# Altium project LAD_MCU.PrjPcb (part 1 of 2)
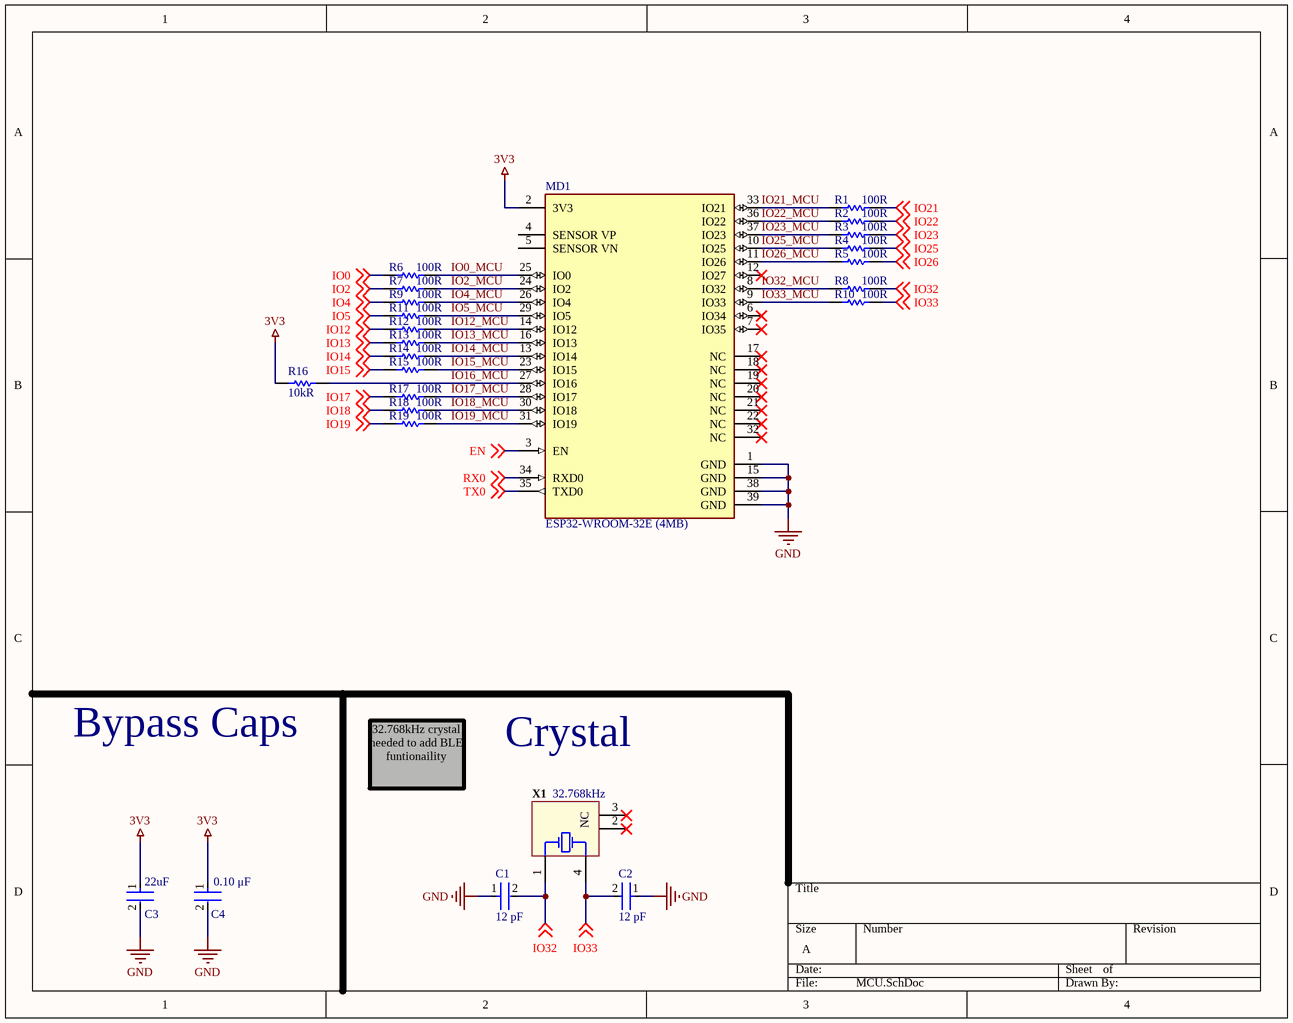
[diagram p0: MCU.SchDoc]
5 sheets, 61 parts. Net scope: global (net labels, ports and power ports of the same name join across sheets).
Board file: MCU.PcbDoc
Sheets:
  MCU.SchDoc
  Connectors.SchDoc
  USB.SchDoc
  Programming.SchDoc
  Power.SchDoc

## Sheet MCU.SchDoc
size A; SheetNumber: 1; SheetTotal: 5

### Parts
C1  value 12 pF  [FP-C0805C-DN-MFG]  (hidden comment: C0805C120J5GACTU)
C2  value 12 pF  [FP-C0805C-DN-MFG]  (hidden comment: C0805C120J5GACTU)
C3  Capacitance: 22uF  [FP-GRM21B-0_15-MFG]  (hidden comment: GRM21BR60J226ME39L)
C4  value 0.10 μF  [FP-C1206C-EB-MFG]  (hidden comment: C1206C104K1RACTU)
MD1  ESP32-WROOM-32E (4MB)  [FP-ESP32-WROOM-32E_4MB-MFG]
R1  value 100R  [RESC3216X65X50NL15T25]  (hidden comment: TNPW1206100RBEEN)
R2  value 100R  [RESC3216X65X50NL15T25]  (hidden comment: TNPW1206100RBEEN)
R3  value 100R  [RESC3216X65X50NL15T25]  (hidden comment: TNPW1206100RBEEN)
R4  value 100R  [RESC3216X65X50NL15T25]  (hidden comment: TNPW1206100RBEEN)
R5  value 100R  [RESC3216X65X50NL15T25]  (hidden comment: TNPW1206100RBEEN)
R6  value 100R  [RESC3216X65X50NL15T25]  (hidden comment: TNPW1206100RBEEN)
R7  value 100R  [RESC3216X65X50NL15T25]  (hidden comment: TNPW1206100RBEEN)
R8  value 100R  [RESC3216X65X50NL15T25]  (hidden comment: TNPW1206100RBEEN)
R9  value 100R  [RESC3216X65X50NL15T25]  (hidden comment: TNPW1206100RBEEN)
R10  value 100R  [RESC3216X65X50NL15T25]  (hidden comment: TNPW1206100RBEEN)
R11  value 100R  [RESC3216X65X50NL15T25]  (hidden comment: TNPW1206100RBEEN)
R12  value 100R  [RESC3216X65X50NL15T25]  (hidden comment: TNPW1206100RBEEN)
R13  value 100R  [RESC3216X65X50NL15T25]  (hidden comment: TNPW1206100RBEEN)
R14  value 100R  [RESC3216X65X50NL15T25]  (hidden comment: TNPW1206100RBEEN)
R15  value 100R  [RESC3216X65X50NL15T25]  (hidden comment: TNPW1206100RBEEN)
R16  value 10kR  [RESC2013X60X35NL10T20]  (hidden comment: RC0805FR-0710KL)
R17  value 100R  [RESC3216X65X50NL15T25]  (hidden comment: TNPW1206100RBEEN)
R18  value 100R  [RESC3216X65X50NL15T25]  (hidden comment: TNPW1206100RBEEN)
R19  value 100R  [RESC3216X65X50NL15T25]  (hidden comment: TNPW1206100RBEEN)
X1  Frequency: 32.768kHz  [ABRA-ABS25-4_V]  (hidden comment: ABS25-32.768KHZ-6-T)

### Nets
3V3: C3.1 C4.1 MD1.2(3V3) R16.2
GND: C1.1 C2.1 C3.2 C4.2 MD1.1(GND) MD1.15(GND) MD1.38(GND) MD1.39(GND)
EN: MD1.3(EN) ; off-sheet EN
IO0: R6.1 ; off-sheet IO0
IO0_MCU: MD1.25(IO0) R6.2
IO2: R7.1 ; off-sheet IO2
IO2_MCU: MD1.24(IO2) R7.2
IO4: R9.1 ; off-sheet IO4
IO4_MCU: MD1.26(IO4) R9.2
IO5: R11.1 ; off-sheet IO5
IO5_MCU: MD1.29(IO5) R11.2
IO12: R12.1 ; off-sheet IO12
IO12_MCU: MD1.14(IO12) R12.2
IO13: R13.1 ; off-sheet IO13
IO13_MCU: MD1.16(IO13) R13.2
IO14: R14.1 ; off-sheet IO14
IO14_MCU: MD1.13(IO14) R14.2
IO15: R15.1 ; off-sheet IO15
IO15_MCU: MD1.23(IO15) R15.2
IO16_MCU: MD1.27(IO16) R16.1
IO17: R17.1 ; off-sheet IO17
IO17_MCU: MD1.28(IO17) R17.2
IO18: R18.1 ; off-sheet IO18
IO18_MCU: MD1.30(IO18) R18.2
IO19: R19.1 ; off-sheet IO19
IO19_MCU: MD1.31(IO19) R19.2
IO21: R1.2 ; off-sheet IO21
IO21_MCU: MD1.33(IO21) R1.1
IO22: R2.2 ; off-sheet IO22
IO22_MCU: MD1.36(IO22) R2.1
IO23: R3.2 ; off-sheet IO23
IO23_MCU: MD1.37(IO23) R3.1
IO25: R4.2 ; off-sheet IO25
IO25_MCU: MD1.10(IO25) R4.1
IO26: R5.2 ; off-sheet IO26
IO26_MCU: MD1.11(IO26) R5.1
IO32: C1.2 R8.2 X1.1(X1) ; off-sheet IO32
IO32_MCU: MD1.8(IO32) R8.1
IO33: C2.2 R10.2 X1.4(X2) ; off-sheet IO33
IO33_MCU: MD1.9(IO33) R10.1
RX0: MD1.34(RXD0) ; off-sheet RX0
TX0: MD1.35(TXD0) ; off-sheet TX0

Not connected (* = marked no-connect by the designer): MD1 4(SENSOR_VP) 5(SENSOR_VN) 6(IO34)* 7(IO35)* 12(IO27)* 17(NC)* 18(NC)* 19(NC)* 20(NC)* 21(NC)* 22(NC)* 32(NC)*; X1 2(NC)* 3(NC)*

### Notes on the sheet
- Bypass Caps
- Crystal
- 32.768kHz crystal needed to add BLE funtionaility

### Library data of the parts
C1 C2 = CMP-2007-00441-2: CAP CER 12PF 50V C0G/NP0 0805; Manufacturer: KEMET; Temperature Characteristic: C0G; Temperature Coefficient: 30ppm/°C; Material: Ceramic; Tolerance: 0.05; Multilayer: Yes; Tolerance  (fill in as +-): 5%; Capacitance: 12 pF; Height: 0.88mm; ComponentLink2URL: https://content.kemet.com/datasheets/KEM_C1003_C0G_SMD.pdf; Automotive: No; Device Class L2: Capacitors; Digikey Description: CAP CER 12PF 50V C0G/NP0 0805; Device Class L3: Ceramic Capacitors; Voltage Rating: 50 V; Mouser Description: Multilayer Ceramic Capacitors MLCC - SMD/SMT 50volts 12pF C0G 5%; Device Class L1: Passive Components; ComponentLink2Description: Datasheet; RoHS: TRUE; Temperature Range High: +125°C; Lead Free: Yes; Category: Cap; Ipc Land Pattern Name: CAPC200125X78; Package: C0805C-DN; Manufacturer Part Number: C0805C120J5GACTU; Octopart: https://octopart.com/c0805c120j5gactu-kemet-126518; Temperature Range Low: -55°C; Temperature: -55°C to +125°C; Supplier: Digikey; Supplier Part Number: 399-C0805C120J5GAC7800CT-ND; Stock: 105044; Pricing: 1=0.12, 10=0.081, 50=0.0482, 100=0.038, 500=0.02804, 1000=0.02321 (USD); Mounting Technology: Surface Mount; Pins: 2; Dielectric Material: Ceramic; Case/Package: 0805; Terminal Finish: Nickel; Package Shape: Rectangular; Min Operating Temperature: -55°C; Max Operating Temperature: 125°C; JESD-609 Code: e3; Capacitor Type: Ceramic; Packaging: Tape and Reel; Tolerance (fill in as +-): 5%; Rated DC Voltage (URdc): 50V; Temperature Characteristics Code: C0G; Termination: Wraparound; Reach SVHC Compliant: Yes; RoHS Compliant: Yes; ComponentLink1URL: https://datasheet.ciiva.com:443/pdfs/VipMasterIC/IC/KEME/KEME-S-A0007600110/KEME-S-A0007597378-1.pdf?src-supplier=IHS+Markit; ComponentLink1Description: https://datasheet.ciiva.com:443/pdfs/VipMasterIC/IC/KEME/KEME-S-A0007600110/KEME-S-A0007597378-1.pdf?src-supplier=IHS+Markit
C3 = CMP-2007-03385-2: Chip Multilayer Ceramic Capacitors for General Purpose, 0805, 22uF, X5R, 15%, 20%, 6.3V; Manufacturer: Murata; Multilayer: Yes; Material: Ceramic; Max Operating Temperature: 85°C; Voltage: 6.3V; Min Operating Temperature: -55°C; Case/Package: 0805; Thickness: 0.053inch; Dielectric: X5R; Packaging: Tape and Reel; Depth: 1.25mm; Termination: SMD/SMT; Voltage Rating (DC): 6.3V; Radiation Hardening: No; Tolerance: 20%; Mount: Surface Mount; Lead Free: Lead Free; Package Quantity: 1; REACH SVHC: No SVHC; Voltage Rating: 6.3V; Length: 2mm; Case Code (Imperial): 0805; Case Code (Metric): 2012; Width: 0.049inch; Height: 1.25mm; Supplier: Digikey; Supplier Part Number: 490-1719-1-ND; Manufacturer Part Number: GRM21BR60J226ME39L; RoHS: Yes; Category: Ceramic Capacitors; Stock: 3670406; Pricing: 1=0.3, 10=0.196, 50=0.1444, 100=0.1177, 500=0.09288, 1000=0.07844 (USD); Mounting Technology: Surface Mount; Pins: 2; Dielectric Material: Ceramic; Package Shape: Rectangular; Terminal Finish: Nickel; JESD-609 Code: e3; Value: 22uF; Capacitor Type: Ceramic; Tolerance  (fill in as +-): 20%; Package Style: SMTMeter; Tolerance (fill in as +-): 20%; Rated DC Voltage (URdc): 6.3V; Temperature Characteristics Code: X5R; Reach SVHC Compliant: Yes; RoHS Compliant: Yes; ComponentLink1URL: https://psearch.en.murata.com:443/capacitor/product/GRM21BR60J226ME39%23.pdf?src-supplier=IHS+Markit; ComponentLink1Description: https://psearch.en.murata.com:443/capacitor/product/GRM21BR60J226ME39%23.pdf?src-supplier=IHS+Markit
C4 = CMP-03020-000153-1: CAP CER 0.1UF 100V X7R 1206; Manufacturer: KEMET; Tolerance: 0.1; Material: Ceramic; Temperature Coefficient: 15%; Automotive Grade: Grade 0; Multilayer: Yes; Tolerance  (fill in as +-): 10%; Voltage Rating: 100 V; Automotive: Yes; Ipc Land Pattern Name: CAPC320160X78; Device Class L1: Passive Components; ComponentLink2Description: Datasheet; Temperature Range Low: -55°C; Category: Cap; Octopart: https://octopart.com/c1206c104k1ractu-kemet-89521; Height: 0.88mm; Lead Free: Yes; Digikey Description: CAP CER 0.1UF 100V X7R 1206; Mouser Description: CAP CER 0.1UF 100V X7R 1206; Device Class L3: Ceramic Capacitors; Device Class L2: Capacitors; ComponentLink2URL: https://content.kemet.com/datasheets/KEM_C1007_X8R_ULTRA_150C_SMD.pdf; Temperature Range High: +150°C; Temperature Characteristic: X7R; Manufacturer Part Number: C1206C104K1RACTU; RoHS: TRUE; Capacitance: 0.10 μF; Package: C1206C-EB; Temperature: -55°C to +150°C; Supplier: Digikey; Supplier Part Number: 399-C1206C104K1RAC7800CT-ND; Stock: 96437; Pricing: 1=0.22, 10=0.144, 50=0.101, 100=0.0816, 500=0.0606, 1000=0.05302 (USD); Mounting Technology: Surface Mount; Pins: 2; Dielectric Material: Ceramic; Case/Package: 1206; Terminal Finish: Nickel; Package Shape: Rectangular; Min Operating Temperature: -55°C; Max Operating Temperature: 125°C; JESD-609 Code: e3; Capacitor Type: Ceramic; Packaging: Tape and Reel; Tolerance (fill in as +-): 10%; Rated DC Voltage (URdc): 100V; Temperature Characteristics Code: X7R; Package Style: SMTMeter; Termination: Wraparound; Length: 3.2mm; Width: 1.6mm; Reach SVHC Compliant: Yes; RoHS Compliant: Yes; ComponentLink1URL: https://datasheet.ciiva.com:443/pdfs/VipMasterIC/IC/KEME/KEME-S-A0008991654/KEME-S-A0008991654-1.pdf?src-supplier=IHS+Markit; ComponentLink1Description: https://datasheet.ciiva.com:443/pdfs/VipMasterIC/IC/KEME/KEME-S-A0008991654/KEME-S-A0008991654-1.pdf?src-supplier=IHS+Markit
MD1 = CMP-194065-000026-1: RX TXRX MOD WIFI TRACE ANT SMD
R1-R15 R17-R19 = CMP-2003-04635-1: Manufacturer: Vishay Dale; Manufacturer Series: TNPW; Tolerance: 0.1%; Power: 250mW; Rated Temperature: 70°C; Temperature Coefficient: 25ppm/°C; Working Voltage: 200V; Part Number: TNPW1206100RBEEN; Supplier: Digikey; Supplier Part Number: 541-3833-1-ND; Manufacturer Part Number: TNPW1206100RBEEN; RoHS: Yes; Category: Chip SMD Resistors; Stock: 9436; Pricing: 1=0.93, 10=0.658, 50=0.5002, 100=0.4416, 500=0.32664 (USD); Mounting Technology: Surface Mount; Pins: 2; Case/Package: 1206; Terminal Finish: Tin; Package Shape: Rectangular; Min Operating Temperature: -55°C; Max Operating Temperature: 125°C; JESD-609 Code: e3; Resistor Type: FIXED RESISTOR; Packaging: Tape and Reel; Technology: THIN FILM; Termination: Wraparound; Reach SVHC Compliant: Yes; RoHS Compliant: Yes; ComponentLink1URL: https://datasheet.ciiva.com:443/pdfs/VipMasterIC/IC/DALE/DALES05753/DALES05753-1.pdf?src-supplier=IHS+Markit; ComponentLink1Description: https://datasheet.ciiva.com:443/pdfs/VipMasterIC/IC/DALE/DALES05753/DALES05753-1.pdf?src-supplier=IHS+Markit; ComponentLink2URL: https://datasheet.ciiva.com/2613/tnpw-e3-2613292.pdf?src-supplier=Digikey; ComponentLink2Description: https://datasheet.ciiva.com/2613/tnpw-e3-2613292.pdf?src-supplier=Digikey; ComponentLink3URL: https://datasheet.ciiva.com/8979/tnpw-e3-8979929.pdf?src-supplier=Avnet; ComponentLink3Description: https://datasheet.ciiva.com/8979/tnpw-e3-8979929.pdf?src-supplier=Avnet; ComponentLink4URL: https://datasheet.ciiva.com/8981/tnpw-e3-8981015.pdf?src-supplier=Avnet; ComponentLink4Description: https://datasheet.ciiva.com/8981/tnpw-e3-8981015.pdf?src-supplier=Avnet
R16 = CMP-1659-00013-4: Chip Resistor, 10 KOhm, +/- 1%, 0.125 W, -55 to 155 degC, 0805 (2012 Metric), RoHS, Tape and Reel; Manufacturer: Yageo; Voltage Rating: 150 V; Power: 125mW; Rated Temperature: 70°C; Temperature Coefficient: 100ppm/°C; Additional Feature: LASER TRIMMABLE; Working Voltage: 150V; Package Length: 2mm; Package Height: 0.5mm; Package Width: 1.25mm; Mount: Surface Mount; ComponentLink1Description: Manufacturer URL; ComponentLink2URL: http://www.yageo.com/documents/recent/PYu-RC_Group_51_RoHS_L_04.pdf; Pins: 2; Length: 2 mm; Min Operating Temperature: -55 degC; Height: 0.5 mm; Mounting Technology: Surface Mount; RoHSCompliant: true; REACH SVHC: No SVHC; ComponentLink1URL: http://www.yageo.com/; Max Operating Temperature: 155 degC; PackageReference: 0805; DatasheetVersion: Rev. 4, 02/2016; Package Quantity: 5000; Packaging: Tape and Reel; ComponentLink2Description: Datasheet; PackageDescription: 2-Pin Surface Mounted Device, Body 2 x 1.25 mm; Supplier: Digikey; Supplier Part Number: 311-10.0KCRCT-ND; Manufacturer Part Number: RC0805FR-0710KL; RoHS: Yes; Category: Chip SMD Resistors; Stock: 4430741; Pricing: 1=0.1, 10=0.027, 50=0.017, 100=0.0142, 500=0.00976, 1000=0.00844 (USD); Package Shape: Rectangular; Terminal Finish: Nickel; Case/Package: 0805; Tolerance: 1%; JESD-609 Code: e3; Resistor Type: FIXED RESISTOR; Construction: Chip; Package Style: SMTMeter; Technology: METAL GLAZE/THICK FILM; Termination: Wraparound; Reach SVHC Compliant: Yes; RoHS Compliant: Yes; ComponentLink3URL: https://datasheet.ciiva.com:443/pdfs/VipMasterIC/IC/YAGO/YAGO-S-A0008145938/YAGO-S-A0008145938-1.pdf?src-supplier=IHS+Markit; ComponentLink3Description: https://datasheet.ciiva.com:443/pdfs/VipMasterIC/IC/YAGO/YAGO-S-A0008145938/YAGO-S-A0008145938-1.pdf?src-supplier=IHS+Markit; ComponentLink4URL: https://datasheet.ciiva.com/11808/0900766b8106beab-11808151.pdf?src-supplier=Rs; ComponentLink4Description: https://datasheet.ciiva.com/11808/0900766b8106beab-11808151.pdf?src-supplier=Rs; ComponentLink5URL: https://datasheet.ciiva.com/46447/444164-46447563.pdf?src-supplier=Element14; ComponentLink5Description: https://datasheet.ciiva.com/46447/444164-46447563.pdf?src-supplier=Element14; ComponentLink6URL: https://datasheet.ciiva.com/2456/pyu-r-int-thick-7-2456973.pdf?src-supplier=Digikey; ComponentLink6Description: https://datasheet.ciiva.com/2456/pyu-r-int-thick-7-2456973.pdf?src-supplier=Digikey; ComponentLink7URL: https://datasheet.ciiva.com/2456/pyu-r-int-thick-7-2456974.pdf?src-supplier=Digikey; ComponentLink7Description: https://datasheet.ciiva.com/2456/pyu-r-int-thick-7-2456974.pdf?src-supplier=Digikey; ComponentLink8URL: https://datasheet.ciiva.com/2456/pyu-r-int-thick-7-2456972.pdf?src-supplier=Digikey; ComponentLink8Description: https://datasheet.ciiva.com/2456/pyu-r-int-thick-7-2456972.pdf?src-supplier=Digikey; ComponentLink9URL: https://datasheet.ciiva.com/12669/rc0805-12669688.pdf?src-supplier=Mouser; ComponentLink9Description: https://datasheet.ciiva.com/12669/rc0805-12669688.pdf?src-supplier=Mouser; ComponentLink10URL: https://datasheet.ciiva.com/16747/rc0805-16747087.pdf?src-supplier=Future+Electronics; ComponentLink10Description: https://datasheet.ciiva.com/16747/rc0805-16747087.pdf?src-supplier=Future+Electronics
X1 = CMP-2000-05036-1: Low Frequency Crystal, 32.768 KHz, 6 pF, +/- 20 ppm, -40 to 85 degC, 4-Pin SMD, RoHS, Tape and Reel; Manufacturer: Abracon; Tolerance: 20PPM; ESR: 50kOhms; Case Width: 3.8mm; Case Height: 2.5mm; Case Length: 8mm; Load Capacitance: 6pF; Operating Temperature Range: -40Cto+85C; Package Reference: ABS25; Factory Pack Quantity: 3000; Package Description: 4-Pin Surface Mount Device, Body 8 x 3.8 mm, Pitch 5.5 mm; Termination Style: SMD/SMT; Manufacturer URL: http://www.abracon.com/; Type: LowFrequencyCrystal; Dimensions: 3.8mmWx8mmLx2.5mmH; Product Category: Crystals; Series: ABS25; RoHS: Details; Package / Case: 8mmx3.8mm; Datasheet Version: Jun-17; Brand: ABRACON; Datasheet URL: https://datasheet.ciiva.com/854/abs25-854528.pdf; Packaging: Reel; Mounting Style: SMD/SMT

## Sheet Connectors.SchDoc
size A; SheetNumber: 2; SheetTotal: 5
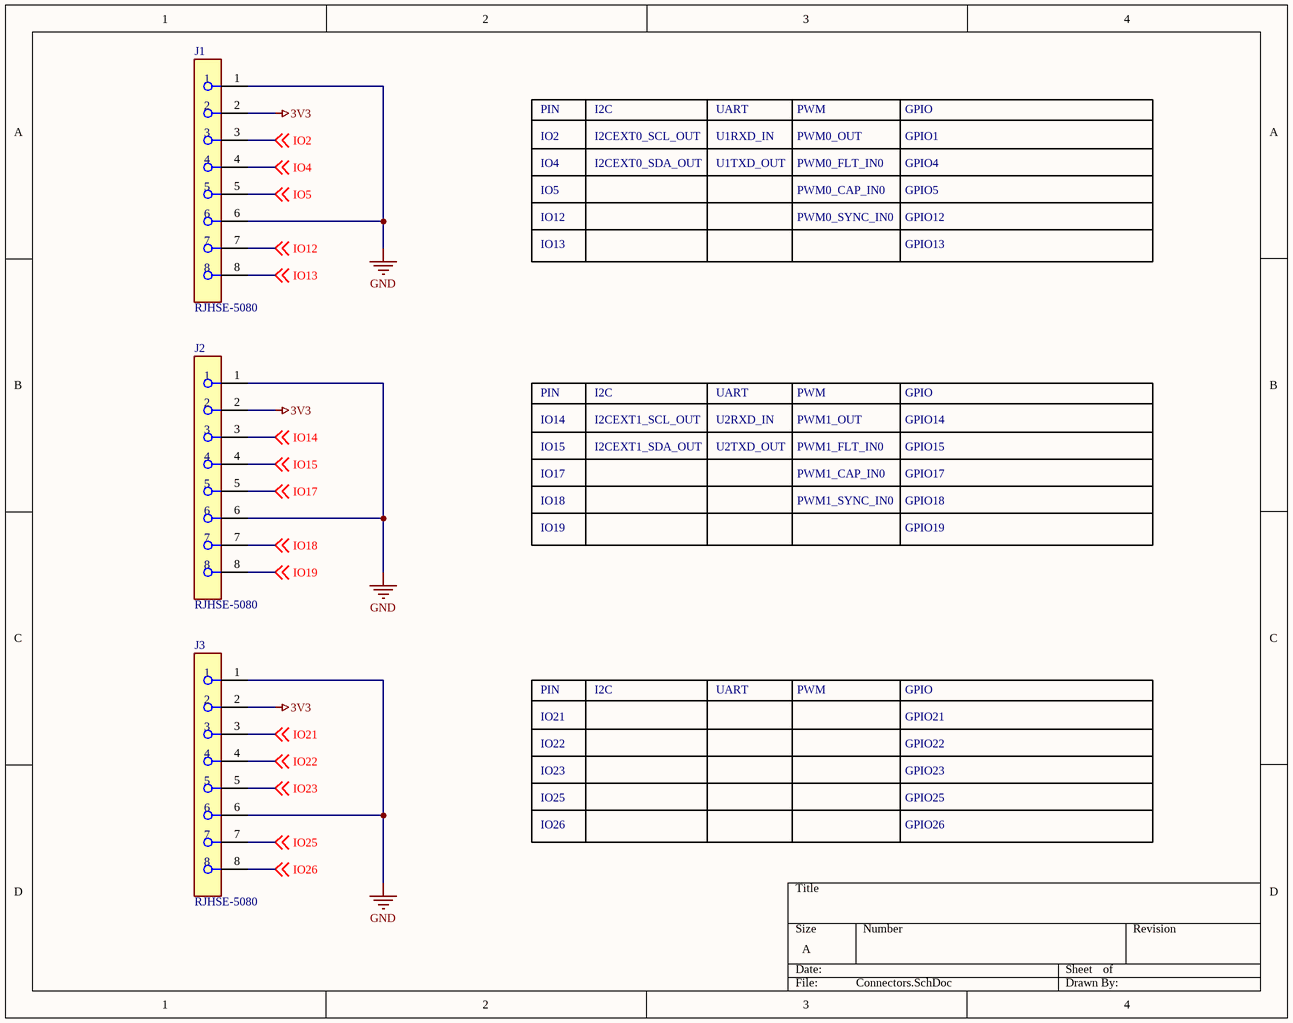
[diagram p1: Connectors.SchDoc]

### Parts
J1  RJHSE-5080  [FP-RJHSE-5080-MFG]
J2  RJHSE-5080  [FP-RJHSE-5080-MFG]
J3  RJHSE-5080  [FP-RJHSE-5080-MFG]

### Nets
3V3: J1.2 J2.2 J3.2
GND: J1.1 J1.6 J2.1 J2.6 J3.1 J3.6
IO2: J1.3 ; off-sheet IO2
IO4: J1.4 ; off-sheet IO4
IO5: J1.5 ; off-sheet IO5
IO12: J1.7 ; off-sheet IO12
IO13: J1.8 ; off-sheet IO13
IO14: J2.3 ; off-sheet IO14
IO15: J2.4 ; off-sheet IO15
IO17: J2.5 ; off-sheet IO17
IO18: J2.7 ; off-sheet IO18
IO19: J2.8 ; off-sheet IO19
IO21: J3.3 ; off-sheet IO21
IO22: J3.4 ; off-sheet IO22
IO23: J3.5 ; off-sheet IO23
IO25: J3.7 ; off-sheet IO25
IO26: J3.8 ; off-sheet IO26

### Notes on the sheet
- PIN
- IO2
- IO4
- I2C
- I2CEXT0_SCL_OUT
- I2CEXT0_SDA_OUT
- UART
- U1RXD_IN
- U1TXD_OUT
- PWM
- PWM0_OUT
- PWM0_FLT_IN0
- GPIO
- GPIO1
- GPIO4
- IO5
- IO12
- PWM0_CAP_IN0
- PWM0_SYNC_IN0
- GPIO5
- GPIO12
- IO13
- GPIO13
- IO14
- I2CEXT1_SCL_OUT
- U2RXD_IN
- PWM1_OUT
- GPIO14
- IO15
- IO17
- IO18
- I2CEXT1_SDA_OUT
- U2TXD_OUT
- PWM1_FLT_IN0
- PWM1_CAP_IN0
- PWM1_SYNC_IN0
- GPIO15
- GPIO17
- GPIO18
- IO19
- GPIO19
- IO21
- IO22
- IO23
- GPIO21
- GPIO22
- GPIO23
- IO25
- IO26
- GPIO25
- GPIO26

### Library data of the parts
J1-J3 = CMP-02366-000003-1: CONN MOD JACK 8P8C R/A UNSHLD; Manufacturer: Amphenol; Current Rating: 1.5A; Voltage Rating: 125V; Pitch: 1.02mm; Conn Orientation: Right Angle; Number Of Contacts: 8; Is Female: yes; Conn Gender: Female; Connector Type: TELECOM AND DATACOM CONNECTOR; Contact Style: TELCOM, MODULAR; Number of Ports: 1; PCB Contact Pattern: STAGGERED; Option: General Purpose; Empty Shell: No; Body Breadth: 0.52inch; Body Depth: 0.59inch; Body Length: 0.62inch; Mounting Option 1: LOCKING; Plating Thickness: 50uin; Reference Standard: UL; Reliability: COMMERCIAL; Lead Free: Yes; Device Class L3: unset; Footprint Url: https://cdn.amphenol-icc.com/media/wysiwyg/files/drawing/rjhse5080.pdf?__cf_chl_jschl_tk__=e349db0bbbb6188a39347cd5e541b92fa02c9719-1587748343-0-AW7tChdeHzRPLX9gSWj7WrKaXQoY9BsmT9Ek0h-T62M9y3Rs9iypFcOtkzb-6sGYQEjFE-jcoNciDETCOZrh1rYyOesac5SvYLoLwHIsHvF4AKBlx-MXmfZUVk9OTTJLqyQq2qMm0PFRLJpNcK0nrKResqOniRSYixG2sPTmOPraH-ULJFBDL602CHqcI9KKBgTq90Jh1OL2Td4moJ99rFsJRJ1Tk_uoxGe8ublcP_ARu-uLpWcQrBcwOcHDTAwL29DAwVaqcH7ta8Ks7WMlHmVl_pILeEDwT0bE9vu5Pa5S3PtNRF1leuFkgi_FMbUxTDulc5xzbXSfng8srUIV1lWXny5nx1fZJEUa_w97yKjffzBMxiWLWVN-V7-uqAaPbyv_m-wRyw5O25OZNyJOeGU; ComponentLink2URL: https://cdn.amphenol-icc.com/media/wysiwyg/files/documentation/datasheet/inputoutput/io-modjack-rjhse.pdf; Device Class L1: Connectors; Package: CONN_MOD_JACK; Mouser Description: Modular Connectors / Ethernet Connectors R/A RJ45 NONSHIELDED 8 CONT NO LEDS; Manufacturer Part Number: RJHSE-5080; Octopart: https://octopart.com/rjhse-5080-amphenol-45060; Category: Conn; Height: 0.535inch; Temperature: -55°C to +85°C; Digikey Description: CONN MOD JACK 8P8C R/A UNSHLD; Device Class L2: Modular / Ethernet Connectors; Contact Material: Gold,Nickel; ComponentLink2Description: Datasheet; Temperature Range Low: -55°C; RoHS: TRUE; Automotive: No; Temperature Range High: +85°C; Supplier: Digikey; Supplier Part Number: RJHSE-5080-ND; Stock: 69947; Pricing: 1=1.03, 10=0.867, 36=0.83194, 72=0.81417, 108=0.7788, 252=0.70802, 504=0.6372, 1008=0.56641, 2520=0.51331 (USD); Mounting Technology: Panel,Board; Contact Finish - Mating: GOLD (50) OVER NICKEL (50); Contact Finish - Termination: Matte Tin (Sn); Insulation Color: Black; Insulation Material: Thermoplastic; Shell Material: Polyethylene; JESD-609 Code: e3; Body/Shell Style: JACK; Contact Gender: Female; Mounting Style: RIGHT ANGLE; Termination: Solder; Filter Feature: No; Mixed Contacts: No; Terminal Length: 0.1inch; Terminal Pitch: 2.032mm; Flammability Rating: UL94 V-0; Reach SVHC Compliant: Yes; RoHS Compliant: Yes; DIN Conformance: No; IEC Conformance: No; MIL Conformance: No; ComponentLink1URL: https://datasheet.ciiva.com:443/pdfs/VipMasterIC/IC/AMPH/AMPH-S-A0001396201/AMPH-S-A0001290431-1.pdf?src-supplier=IHS+Markit; ComponentLink1Description: https://datasheet.ciiva.com:443/pdfs/VipMasterIC/IC/AMPH/AMPH-S-A0001396201/AMPH-S-A0001290431-1.pdf?src-supplier=IHS+Markit; ComponentLink3URL: https://datasheet.ciiva.com/685/rjhse5080-685586.pdf?src-supplier=Digikey; ComponentLink3Description: https://datasheet.ciiva.com/685/rjhse5080-685586.pdf?src-supplier=Digikey; ComponentLink4URL: https://datasheet.ciiva.com/7629/1682821-7629402.pdf?src-supplier=Element14; ComponentLink4Description: https://datasheet.ciiva.com/7629/1682821-7629402.pdf?src-supplier=Element14; ComponentLink5URL: https://datasheet.ciiva.com/15171/getdatasheetpartid-643190-15171163.pdf?src-supplier=Verical; ComponentLink5Description: https://datasheet.ciiva.com/15171/getdatasheetpartid-643190-15171163.pdf?src-supplier=Verical; ComponentLink6URL: https://datasheet.ciiva.com/1432/1693748-1432448.pdf?src-supplier=Element14; ComponentLink6Description: https://datasheet.ciiva.com/1432/1693748-1432448.pdf?src-supplier=Element14

## Sheet USB.SchDoc
size A; SheetNumber: 3; SheetTotal: 5
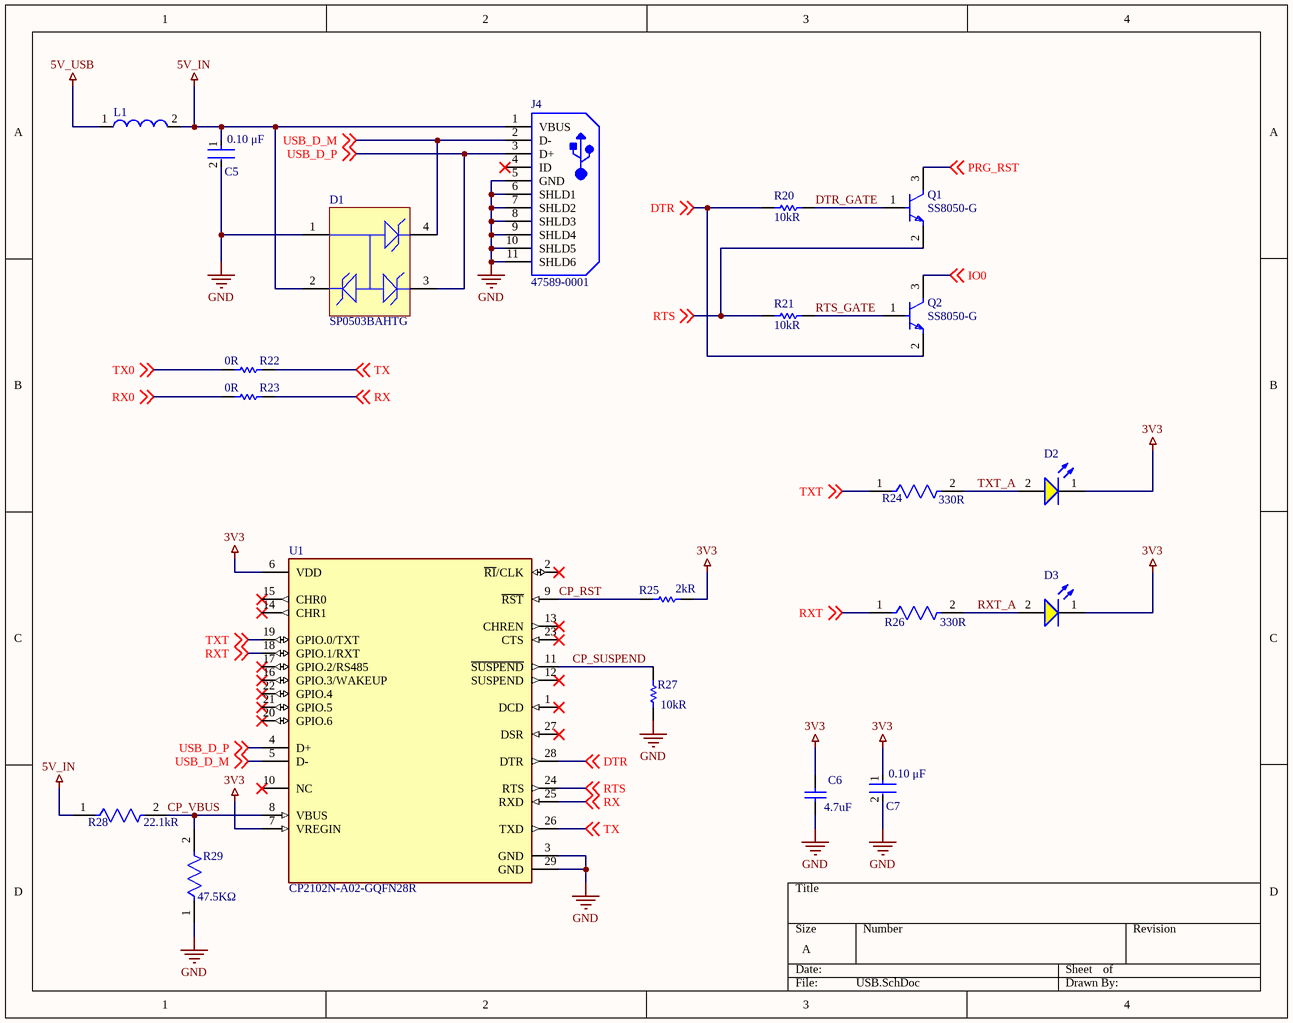
[diagram p2: USB.SchDoc]

### Parts
C5  value 0.10 μF  [FP-C1206C-EB-MFG]  (hidden comment: C1206C104K1RACTU)
C6  value 4.7uF  [CAPC1210(3225)220_M]  (hidden comment: CAP 4.7uF 25V 1210(3225))
C7  value 0.10 μF  [FP-C1206C-EB-MFG]  (hidden comment: C1206C104K1RACTU)
D1  SP0503BAHTG  [LFUS-SOT143-4_V]
D2  150080YS75000  [WL-SMCW_0805_150080xx75000]  (value not drawn)
D3  150080YS75000  [WL-SMCW_0805_150080xx75000]  (value not drawn)
J4  47589-0001  [MOLX-47589-0001_V]
L1  742792093  [SMD-0805]  (value not drawn)
Q1  SS8050-G  [FP-SS8050-G-MFG]
Q2  SS8050-G  [FP-SS8050-G-MFG]
R20  value 10kR  [RESC2013X60X35NL10T20]  (hidden comment: RC0805FR-0710KL)
R21  value 10kR  [RESC2013X60X35NL10T20]  (hidden comment: RC0805FR-0710KL)
R22  value 0R  [RESC2013X50X30LL20T20]  (hidden comment: CRCW08050000Z0EA)
R23  value 0R  [RESC2013X50X30LL20T20]  (hidden comment: CRCW08050000Z0EA)
R24  Resistance: 330R  [FP-CRCW0805-e3-MFG]  (hidden comment: CRCW0805330RFKEA)
R25  value 2kR  [RESC3216X50X50LL20T25]  (hidden comment: RG3216P-2001-B-T1)
R26  Resistance: 330R  [FP-CRCW0805-e3-MFG]  (hidden comment: CRCW0805330RFKEA)
R27  value 10kR  [RESC2013X60X35NL10T20]  (hidden comment: RC0805FR-0710KL)
R28  Resistance: 22.1kR  [FP-RMCF0805-IPC_B]  (hidden comment: RMCF0805FT22K1)
R29  value 47.5KΩ  [FP-RN732A-MFG]  (hidden comment: RN73C2A47K5BTD)
U1  CP2102N-A02-GQFN28R  [FP-CP2102N-A02-GQFN28R-MFG]

### Nets
3V3: C6.2 C7.1 D2.1(K) D3.1(K) R25.2 U1.6(VDD) U1.7(VREGIN)
5V_IN: C5.1 D1.2 J4.1(VBUS) L1.2 R28.1
5V_USB: L1.1
GND: C5.2 C6.1 C7.2 D1.1 J4.5(GND) J4.6(SHLD1) J4.7(SHLD2) J4.8(SHLD3) J4.9(SHLD4) J4.10(SHLD5) J4.11(SHLD6) R27.1 R29.1 U1.3(GND) U1.29(GND)
CP_RST: R25.1 U1.9(~{RST})
CP_SUSPEND: R27.2 U1.11(~{SUSPEND})
CP_VBUS: R28.2 R29.2 U1.8(VBUS)
DTR: Q2.2(E) R20.1 U1.28(DTR) ; off-sheet DTR
DTR_GATE: Q1.1(B) R20.2
IO0: Q2.3(C) ; off-sheet IO0
PRG_RST: Q1.3(C) ; off-sheet PRG_RST
RTS: Q1.2(E) R21.2 U1.24(RTS) ; off-sheet RTS
RTS_GATE: Q2.1(B) R21.1
RX: R23.2 U1.25(RXD) ; off-sheet RX
RX0: R23.1 ; off-sheet RX0
RXT: R26.1 U1.18(GPIO.1/RXT) ; off-sheet RXT
RXT_A: D3.2(A) R26.2
TX: R22.2 U1.26(TXD) ; off-sheet TX
TX0: R22.1 ; off-sheet TX0
TXT: R24.1 U1.19(GPIO.0/TXT) ; off-sheet TXT
TXT_A: D2.2(A) R24.2
USB_D_M: D1.4 J4.2(D-) U1.5(D-) ; off-sheet USB_D_M
USB_D_P: D1.3 J4.3(D+) U1.4(D+) ; off-sheet USB_D_P

Not connected (* = marked no-connect by the designer): J4 4(ID)*; U1 1(DCD)* 2(~{RI}/CLK)* 10(NC)* 12(SUSPEND)* 13(CHREN)* 14(CHR1)* 15(CHR0)* 16(GPIO.3/WAKEUP)* 17(GPIO.2/RS485)* 20(GPIO.6)* 21(GPIO.5)* 22(GPIO.4)* 23(CTS)* 27(DSR)*

### Library data of the parts
C5 C7 = CMP-03020-000153-1: as C4 on sheet MCU; Voltage Rating: 100 V; Automotive: Yes; Ipc Land Pattern Name: CAPC320160X78; Device Class L1: Passive Components; ComponentLink2Description: Datasheet; Temperature Range Low: -55°C; Category: Cap; Octopart: https://octopart.com/c1206c104k1ractu-kemet-89521; Height: 0.88mm; Lead Free: Yes; Digikey Description: CAP CER 0.1UF 100V X7R 1206; Mouser Description: CAP CER 0.1UF 100V X7R 1206; Device Class L3: Ceramic Capacitors; Device Class L2: Capacitors; ComponentLink2URL: https://content.kemet.com/datasheets/KEM_C1007_X8R_ULTRA_150C_SMD.pdf; Temperature Range High: +150°C; Temperature Characteristic: X7R; Manufacturer Part Number: C1206C104K1RACTU; RoHS: TRUE; Capacitance: 0.10 μF; Package: C1206C-EB; Temperature: -55°C to +150°C; Supplier: Digikey; Supplier Part Number: 399-C1206C104K1RAC7800CT-ND; Stock: 96437; Pricing: 1=0.22, 10=0.144, 50=0.101, 100=0.0816, 500=0.0606, 1000=0.05302 (USD); Mounting Technology: Surface Mount; Pins: 2; Dielectric Material: Ceramic; Case/Package: 1206; Terminal Finish: Nickel; Package Shape: Rectangular; Min Operating Temperature: -55°C; Max Operating Temperature: 125°C; JESD-609 Code: e3; Capacitor Type: Ceramic; Packaging: Tape and Reel; Tolerance (fill in as +-): 10%; Rated DC Voltage (URdc): 100V; Temperature Characteristics Code: X7R; Package Style: SMTMeter; Termination: Wraparound; Length: 3.2mm; Width: 1.6mm; Reach SVHC Compliant: Yes; RoHS Compliant: Yes; ComponentLink1URL: https://datasheet.ciiva.com:443/pdfs/VipMasterIC/IC/KEME/KEME-S-A0008991654/KEME-S-A0008991654-1.pdf?src-supplier=IHS+Markit; ComponentLink1Description: https://datasheet.ciiva.com:443/pdfs/VipMasterIC/IC/KEME/KEME-S-A0008991654/KEME-S-A0008991654-1.pdf?src-supplier=IHS+Markit
C6 = CMP-1038-02151-2: CAP 4.7uF 25V ±10% 1210 (3225 Metric) Thickness 2.2mm SMD; Manufacturer: KEMET; Manufacturer Part Number: C1210C475K3RACTU; Case-Metric: 3225; Case-EIA: 1210; Tolerance: Â±10%; Dielectric Material: Ceramic; Multilayer: Yes; Temperature Characteristics Code: X7R; Technology: SMT; Max Thickness: 2.2 mm; Rated Voltage: 25 V; Supplier: Digikey; Supplier Part Number: 399-C1210C475K3RAC7800CT-ND; RoHS: Yes; Category: Ceramic Capacitors; Stock: 9226; Pricing: 1=0.66, 10=0.462, 50=0.3888, 100=0.3166, 500=0.26386, 1000=0.2222 (USD); Mounting Technology: Surface Mount; Pins: 2; Package Shape: Rectangular; Case/Package: 1210; Terminal Finish: Nickel; Min Operating Temperature: -55°C; Max Operating Temperature: 125°C; Capacitor Type: Ceramic; Tolerance  (fill in as +-): 10%; Package Style: SMTMeter; Packaging: Tape and Reel; Tolerance (fill in as +-): 10%; Rated DC Voltage (URdc): 25V; Termination: Wraparound; JESD-609 Code: e3; Length: 3.2mm; Width: 2.5mm; Height: 1.25mm; Reach SVHC Compliant: Yes; RoHS Compliant: Yes; ComponentLink1URL: https://datasheet.ciiva.com:443/pdfs/VipMasterIC/IC/KEME/KEME-S-A0008991654/KEME-S-A0008991654-1.pdf?src-supplier=IHS+Markit; ComponentLink1Description: https://datasheet.ciiva.com:443/pdfs/VipMasterIC/IC/KEME/KEME-S-A0008991654/KEME-S-A0008991654-1.pdf?src-supplier=IHS+Markit
D1 = CMP-2000-05191-1: TVS Diode Array, 30 pF, 30 KV, -40 to 85 degC, 4-Pin SOT143, RoHS, Tape and Reel; Manufacturer: Littelfuse; Direction Type: Uni-Directional; Product Height (mm): 1.05mm; Leakage Current (Max): 0.1uA; Clamping Voltage (Max): 8V; Reverse Stand-off Voltage: 5.5(Min)V; Configuration: Triple; Working Voltage: 5.5V; Product Length (mm): 3.04mm; Working Voltage (Max): 5.5V(Min); Capacitance Value: 30pF; Rad Hardened: No; Number of Elements: 3; Product Depth (mm): 1.4mm; Operating Temperature Max Deg. C: 85C; Suppressor Type: TVS; Operating Temperature Min Deg. C: -40C; Operating Temp Range: -40Cto85C; Mounting: SurfaceMount; Package / Case: SOT-143; Datasheet Version: Dec-13; Package Type: SOT-143; Packaging: TapeandReel; Pin Count: 3+Tab; Operating Temperature Classification: Industrial; Datasheet URL: https://datasheet.ciiva.com/15143/getdatasheetpartid-116020-15143550.pdf; Manufacturer URL: http://www.littelfuse.com/; Leakage Current: 0.1uA; Mounting Style: SurfaceMount; Clamping Voltage: 8V; Polarity: Uni-Directional
D2 D3 = CMP-1426-00012-2: NexarPartId: 29717784; Manufacturer: Wurth Electronics; Dominant Wavelength: 590nm; Max Reverse Voltage (DC): 5V; Forward Voltage: 2V; Peak Wavelength: 595nm; Max Junction Temperature (Tj): 95°C; Lens Style: Clear, Rectangular; Power Dissipation: 72mW; Test Current: 20mA; Color: Yellow; Forward Current: 100mA; Luminous Intensity: 120mcd; Viewing Angle: 140°; Shape: Rectangular; Channels: 1; Optoelectronic Device Type: SINGLE COLOR LED; Overall Height: 0.7mm; Min Operating Temperature: -40°C; Case/Package: 0805; REACH SVHC: Unknown; Max Operating Temperature: 85°C; Case Code (Imperial): 0805; Mount: Surface Mount; Packaging: Tape and Reel; RoHS: Compliant; Case Code (Metric): 2012; Reverse Voltage: 5V; Height: 700µm; Width: 1.25mm; Wavelength: 590nm; Length: 2mm; Supplier: Digikey; Supplier Part Number: 732-4987-1-ND; Manufacturer Part Number: 150080YS75000; Category: LEDs; Stock: 32209; Pricing: 1=0.19, 50=0.176, 100=0.151, 500=0.131 (USD); Mounting Technology: Surface Mount; Pins: 2; Luminous Intensity-Nom: 120mcd; Size: 1.4mm; Terminal Pitch: 2.1mm; Reach SVHC Compliant: Yes; RoHS Compliant: Yes; ComponentLink1URL: https://datasheet.ciiva.com:443/pdfs/VipMasterIC/IC/MIDC/MIDC-S-A0007455942/MIDC-S-A0007455942-1.pdf?src-supplier=IHS+Markit; ComponentLink1Description: https://datasheet.ciiva.com:443/pdfs/VipMasterIC/IC/MIDC/MIDC-S-A0007455942/MIDC-S-A0007455942-1.pdf?src-supplier=IHS+Markit; ComponentLink2URL: https://datasheet.ciiva.com/23843/150080ys75000-23843256.pdf?src-supplier=Newark; ComponentLink2Description: https://datasheet.ciiva.com/23843/150080ys75000-23843256.pdf?src-supplier=Newark; ComponentLink3URL: https://datasheet.ciiva.com/29279/759438-da-01-en-chipled-0805-w-kl-gelb-150080ys75000-29279034.pdf?src-supplier=Conrad; ComponentLink3Description: https://datasheet.ciiva.com/29279/759438-da-01-en-chipled-0805-w-kl-gelb-150080ys75000-29279034.pdf?src-supplier=Conrad; ComponentLink4URL: https://datasheet.ciiva.com/22656/1911353-22656971.pdf?src-supplier=Element14; ComponentLink4Description: https://datasheet.ciiva.com/22656/1911353-22656971.pdf?src-supplier=Element14; ComponentLink5URL: https://datasheet.ciiva.com/29563/150080ys75000-29563020.pdf?src-supplier=Digikey; ComponentLink5Description: https://datasheet.ciiva.com/29563/150080ys75000-29563020.pdf?src-supplier=Digikey; ComponentLink6URL: https://datasheet.ciiva.com/29563/150080ys75000-29563019.pdf?src-supplier=Digikey; ComponentLink6Description: https://datasheet.ciiva.com/29563/150080ys75000-29563019.pdf?src-supplier=Digikey; ComponentLink7URL: https://datasheet.ciiva.com/29563/150080ys75000-29563021.pdf?src-supplier=Digikey; ComponentLink7Description: https://datasheet.ciiva.com/29563/150080ys75000-29563021.pdf?src-supplier=Digikey
J4 = CMP-2000-05610-1: Right Angle Female Type AB Micro USB Connector, 30 V, 1.8 A, -30 to 85 degC, RoHS, Tape and Reel; Number of Ports: 1Port; Current Rating: 1.8A; Brand: Molex; Connector Type: MicroUSBTypeABreceptacle; Number of Contacts: 5Contact; Voltage Rating: 30VAC; Color: Black; Product: MicroUSBTypeABConnectors; Package URL: http://www.molex.com/pdm_docs/sd/475890001_sd.pdf; Contact Plating: Gold; Datasheet URL: http://www.molex.com/webdocs/datasheets/pdf/en-us/0475890001_IO_CONNECTORS.pdf; Operating Temperature Range: -20Cto+85C; Termination Style: SMD/SMT; Mounting Angle: Right; Package Reference: 47589-0001; Gender: Female; Package Description: Micro USB Connector, Pitch 0.65 mm, 5 Positions, Body 7.5 x 5.6 mm; Mounting Technology: SurfaceMount; Contact Material: CopperAlloy; Packaging: Reel; RoHS: True; Standard: USB; Manufacturer URL: http://www.molex.com/; Manufacturer: Molex; Datasheet Version: 12/2016; Product Category: USBConnectors; Series: 47589
L1 = CMP-0220-00169-1: SMD EMI Suppression Ferrite Bead WE-CBF, Z = 2200 Ohm; Manufacturer: Wurth Electronics; DC Resistance-Max: 600mR; Filter Type: FERRITE CHIP; Clock Frequency: 100MHz; Min Frequency: 80MHz; Channels: 1; Output Impedance: 2.2kR; Current Rating: 200mA; DatasheetVersion: Dec-2005; ComponentLink2URL: http://www.we-online.de/katalog/media/pdf/742792093.pdf; PackageDescription: Chip Inductor, 2-Leads, Body 2.0 x 1.2 mm; Impedance: 2200 Ohm; ComponentLink2Description: Datasheet; ComponentLink1Description: Manufacturer Link; PackageReference: SMD-0805; ComponentLink1URL: http://www.we-online.com; PackageVersion: 2005; Supplier: Digikey; Supplier Part Number: 732-1609-1-ND; Manufacturer Part Number: 742792093; RoHS: Yes; Category: Ferrite Beads and Chips; Stock: 137435; Pricing: 1=0.21, 50=0.209, 100=0.192, 500=0.183, 1000=0.176, 2000=0.167 (USD); Mounting Technology: Surface Mount; Material: Ferrite; Case Code: 0805; Terminal Finish: Nickel; Min Operating Temperature: -55°C; Max Operating Temperature: 125°C; JESD-609 Code: e3; Construction: Multi-Layer; Length: 2mm; Width: 1.2mm; Height: 0.9mm; Reach SVHC Compliant: Yes; RoHS Compliant: Yes; ComponentLink3URL: https://datasheet.ciiva.com:443/pdfs/VipMasterIC/IC/MIDC/MIDC-S-A0008919821/MIDC-S-A0008919976-1.pdf?src-supplier=IHS+Markit; ComponentLink3Description: https://datasheet.ciiva.com:443/pdfs/VipMasterIC/IC/MIDC/MIDC-S-A0008919821/MIDC-S-A0008919976-1.pdf?src-supplier=IHS+Markit; ComponentLink4URL: https://datasheet.ciiva.com/1475/742792093-1475025.pdf?src-supplier=Farnell; ComponentLink4Description: https://datasheet.ciiva.com/1475/742792093-1475025.pdf?src-supplier=Farnell; ComponentLink5URL: https://datasheet.ciiva.com/11799/0900766b80bbd134-11799557.pdf?src-supplier=Rs; ComponentLink5Description: https://datasheet.ciiva.com/11799/0900766b80bbd134-11799557.pdf?src-supplier=Rs; ComponentLink6URL: https://datasheet.ciiva.com/4940/742792093-88569-4940476.pdf?src-supplier=Mouser; ComponentLink6Description: https://datasheet.ciiva.com/4940/742792093-88569-4940476.pdf?src-supplier=Mouser; ComponentLink7URL: https://datasheet.ciiva.com/1013/742792093-1013376.pdf?src-supplier=Digikey; ComponentLink7Description: https://datasheet.ciiva.com/1013/742792093-1013376.pdf?src-supplier=Digikey; ComponentLink8URL: https://datasheet.ciiva.com/14122/742792093-eng-tds-14122810.pdf?src-supplier=Distrelec; ComponentLink8Description: https://datasheet.ciiva.com/14122/742792093-eng-tds-14122810.pdf?src-supplier=Distrelec
Q1 Q2 = CMP-20235-000001-1: NPN TRANSISTOR 1.5A 40V SOT-23 R; Transition Frequency: 100MHz; Max Breakdown Voltage: 25V; Collector Emitter Voltage (VCEO): 400mV; Max Power Dissipation: 300mW; Max Collector Current: 1.5A; Case/Package: TO-236-3; Packaging: Tape and Reel; RoHS Compliant: Yes; Mount: Surface Mount; Collector Emitter Breakdown Voltage: 25V
R20 R21 R27 = CMP-1659-00013-4: as R16 on sheet MCU; Mount: Surface Mount; ComponentLink1Description: Manufacturer URL; ComponentLink2URL: http://www.yageo.com/documents/recent/PYu-RC_Group_51_RoHS_L_04.pdf; Pins: 2; Length: 2 mm; Min Operating Temperature: -55 degC; Height: 0.5 mm; Mounting Technology: Surface Mount; RoHSCompliant: true; REACH SVHC: No SVHC; ComponentLink1URL: http://www.yageo.com/; Max Operating Temperature: 155 degC; PackageReference: 0805; DatasheetVersion: Rev. 4, 02/2016; Package Quantity: 5000; Packaging: Tape and Reel; ComponentLink2Description: Datasheet; PackageDescription: 2-Pin Surface Mounted Device, Body 2 x 1.25 mm; Supplier: Digikey; Supplier Part Number: 311-10.0KCRCT-ND; Manufacturer Part Number: RC0805FR-0710KL; RoHS: Yes; Category: Chip SMD Resistors; Stock: 4430741; Pricing: 1=0.1, 10=0.027, 50=0.017, 100=0.0142, 500=0.00976, 1000=0.00844 (USD); Package Shape: Rectangular; Terminal Finish: Nickel; Case/Package: 0805; Tolerance: 1%; JESD-609 Code: e3; Resistor Type: FIXED RESISTOR; Construction: Chip; Package Style: SMTMeter; Technology: METAL GLAZE/THICK FILM; Termination: Wraparound; Reach SVHC Compliant: Yes; RoHS Compliant: Yes; ComponentLink3URL: https://datasheet.ciiva.com:443/pdfs/VipMasterIC/IC/YAGO/YAGO-S-A0008145938/YAGO-S-A0008145938-1.pdf?src-supplier=IHS+Markit; ComponentLink3Description: https://datasheet.ciiva.com:443/pdfs/VipMasterIC/IC/YAGO/YAGO-S-A0008145938/YAGO-S-A0008145938-1.pdf?src-supplier=IHS+Markit; ComponentLink4URL: https://datasheet.ciiva.com/11808/0900766b8106beab-11808151.pdf?src-supplier=Rs; ComponentLink4Description: https://datasheet.ciiva.com/11808/0900766b8106beab-11808151.pdf?src-supplier=Rs; ComponentLink5URL: https://datasheet.ciiva.com/46447/444164-46447563.pdf?src-supplier=Element14; ComponentLink5Description: https://datasheet.ciiva.com/46447/444164-46447563.pdf?src-supplier=Element14; ComponentLink6URL: https://datasheet.ciiva.com/2456/pyu-r-int-thick-7-2456973.pdf?src-supplier=Digikey; ComponentLink6Description: https://datasheet.ciiva.com/2456/pyu-r-int-thick-7-2456973.pdf?src-supplier=Digikey; ComponentLink7URL: https://datasheet.ciiva.com/2456/pyu-r-int-thick-7-2456974.pdf?src-supplier=Digikey; ComponentLink7Description: https://datasheet.ciiva.com/2456/pyu-r-int-thick-7-2456974.pdf?src-supplier=Digikey; ComponentLink8URL: https://datasheet.ciiva.com/2456/pyu-r-int-thick-7-2456972.pdf?src-supplier=Digikey; ComponentLink8Description: https://datasheet.ciiva.com/2456/pyu-r-int-thick-7-2456972.pdf?src-supplier=Digikey; ComponentLink9URL: https://datasheet.ciiva.com/12669/rc0805-12669688.pdf?src-supplier=Mouser; ComponentLink9Description: https://datasheet.ciiva.com/12669/rc0805-12669688.pdf?src-supplier=Mouser; ComponentLink10URL: https://datasheet.ciiva.com/16747/rc0805-16747087.pdf?src-supplier=Future+Electronics; ComponentLink10Description: https://datasheet.ciiva.com/16747/rc0805-16747087.pdf?src-supplier=Future+Electronics
R22 R23 = CMP-2001-04896-1: Manufacturer: Vishay Dale; Power: 125mW; Rated Temperature: 70°C; Package Height: 0.45mm; Package Length: 2mm; Package Width: 1.25mm; Reference Standard: AEC-Q200; Part Number: CRCW08050000Z0EA; Supplier: Digikey; Supplier Part Number: 541-0.0ACT-ND; Manufacturer Part Number: CRCW08050000Z0EA; RoHS: Yes; Category: Chip SMD Resistors; Stock: 996898; Pricing: 1=0.1, 10=0.043, 25=0.0324, 50=0.0248, 100=0.0173, 250=0.01392, 500=0.01112, 1000=0.00819 (USD); Mounting Technology: Surface Mount; Pins: 2; Package Shape: Rectangular; Case/Package: 0805; Terminal Finish: Nickel; Min Operating Temperature: -55°C; Max Operating Temperature: 155°C; JESD-609 Code: e3; Resistor Type: FIXED RESISTOR; Packaging: Tape and Reel; Technology: METAL GLAZE/THICK FILM; Termination: Wraparound; Construction: Chip; Package Style: SMTMeter; RoHS Compliant: Yes; Reach SVHC Compliant: Yes; ComponentLink1URL: https://datasheet.ciiva.com:443/pdfs/VipMasterIC/IC/VISH/VISH-S-A0007266705/VISH-S-A0007266705-1.pdf?src-supplier=IHS+Markit; ComponentLink1Description: https://datasheet.ciiva.com:443/pdfs/VipMasterIC/IC/VISH/VISH-S-A0007266705/VISH-S-A0007266705-1.pdf?src-supplier=IHS+Markit; ComponentLink2URL: https://datasheet.ciiva.com/11811/0900766b80d98b26-11811304.pdf?src-supplier=Rs; ComponentLink2Description: https://datasheet.ciiva.com/11811/0900766b80d98b26-11811304.pdf?src-supplier=Rs; ComponentLink3URL: https://datasheet.ciiva.com/7841/1720486-7841839.pdf?src-supplier=Element14; ComponentLink3Description: https://datasheet.ciiva.com/7841/1720486-7841839.pdf?src-supplier=Element14; ComponentLink4URL: https://datasheet.ciiva.com/26314/fld-crcw-e3-data-en-26314630.pdf?src-supplier=Distrelec; ComponentLink4Description: https://datasheet.ciiva.com/26314/fld-crcw-e3-data-en-26314630.pdf?src-supplier=Distrelec; ComponentLink5URL: https://datasheet.ciiva.com/7841/1697337-7841629.pdf?src-supplier=Element14; ComponentLink5Description: https://datasheet.ciiva.com/7841/1697337-7841629.pdf?src-supplier=Element14; ComponentLink6URL: https://datasheet.ciiva.com/2463/dcrcwe3-2463038.pdf?src-supplier=Digikey; ComponentLink6Description: https://datasheet.ciiva.com/2463/dcrcwe3-2463038.pdf?src-supplier=Digikey; ComponentLink7URL: https://datasheet.ciiva.com/2463/dcrcwe3-2463039.pdf?src-supplier=Digikey; ComponentLink7Description: https://datasheet.ciiva.com/2463/dcrcwe3-2463039.pdf?src-supplier=Digikey; ComponentLink8URL: https://datasheet.ciiva.com/2463/dcrcwe3-2463037.pdf?src-supplier=Digikey; ComponentLink8Description: https://datasheet.ciiva.com/2463/dcrcwe3-2463037.pdf?src-supplier=Digikey; ComponentLink9URL: https://datasheet.ciiva.com/16719/70201119-16719706.pdf?src-supplier=Allied+Electronics; ComponentLink9Description: https://datasheet.ciiva.com/16719/70201119-16719706.pdf?src-supplier=Allied+Electronics; ComponentLink10URL: https://datasheet.ciiva.com/5543/dcrcwe3-109170-5543096.pdf?src-supplier=Mouser; ComponentLink10Description: https://datasheet.ciiva.com/5543/dcrcwe3-109170-5543096.pdf?src-supplier=Mouser; ComponentLink11URL: https://datasheet.ciiva.com/16389/dcrcwe3-16389338.pdf?src-supplier=Future+Electronics; ComponentLink11Description: https://datasheet.ciiva.com/16389/dcrcwe3-16389338.pdf?src-supplier=Future+Electronics
R24 R26 = CMP-2001-03823-2: RES Thick Film, 330Ω, 1%, 0.125W, 100ppm/°C, 0805; Manufacturer: Vishay; Voltage Rating (DC): 150V; Max Power Dissipation: 125mW; Rated Temperature: 70°C; Value: 330R; Package Height: 0.45mm; Package Length: 2mm; Package Width: 1.25mm; Reference Standard: AEC-Q200; Mount: Surface Mount; Packaging: Tape and Reel; Min Operating Temperature: -55°C; Military Standard: Not; Case Code (Metric): 2012; Height: 0.02inch; Voltage Rating: 150V; Case/Package: 0805; Max Operating Temperature: 155°C; Width: 0.049inch; Case Code (Imperial): 0805; Termination: SMD/SMT; Lead Free: Lead Free; Contact Plating: Tin; Package Quantity: 10; Composition: Thick Film; Length: 2mm; Features: Automotive AEC-Q200; Depth: 1.25mm; Weight: 0.000194oz; Tolerance: 1%; Power Rating: 125mW; Number of Terminations: 2; Temperature Coefficient: 100ppm/°C; Supplier: Digikey; Supplier Part Number: 541-330CCT-ND; Manufacturer Part Number: CRCW0805330RFKEA; RoHS: Yes; Category: Chip SMD Resistors; Stock: 41783; Pricing: 1=0.1, 10=0.038, 50=0.0248, 100=0.021, 500=0.01462, 1000=0.01273 (USD); Mounting Technology: Surface Mount; Pins: 2; Terminal Finish: Nickel; Package Shape: Rectangular; JESD-609 Code: e3; Construction: Chip; Resistor Type: FIXED RESISTOR; Package Style: SMTMeter; Power: 125mW; Technology: METAL GLAZE/THICK FILM; Working Voltage: 150V; Reach SVHC Compliant: Yes; RoHS Compliant: Yes; ComponentLink1URL: https://datasheet.ciiva.com:443/pdfs/VipMasterIC/IC/VISH/VISH-S-A0007266705/VISH-S-A0007266705-1.pdf?src-supplier=IHS+Markit; ComponentLink1Description: https://datasheet.ciiva.com:443/pdfs/VipMasterIC/IC/VISH/VISH-S-A0007266705/VISH-S-A0007266705-1.pdf?src-supplier=IHS+Markit
R25 = CMP-2003-02566-1: Manufacturer: Susumu; Tolerance: 0.1%; Additional Feature: ULTRA PRECISION; Power: 250mW; Rated Temperature: 85°C; Temperature Coefficient: 25ppm/°C; Working Voltage: 150V; Package Height: 0.5mm; Package Length: 3.2mm; Package Width: 1.6mm; Part Number: RG3216P-2001-B-T1; Supplier: Digikey; Supplier Part Number: RG32P2.0KBCT-ND; Manufacturer Part Number: RG3216P-2001-B-T1; RoHS: Yes; Category: Chip SMD Resistors; Stock: 9791; Pricing: 1=0.39, 10=0.285, 50=0.2202, 100=0.1956, 500=0.14638 (USD); Mounting Technology: Surface Mount; Pins: 2; Case/Package: 1206; Package Shape: Rectangular; Terminal Finish: Tin; Min Operating Temperature: -55°C; Max Operating Temperature: 155°C; Resistor Type: FIXED RESISTOR; Construction: Chip; Package Style: SMTMeter; Packaging: Tape and Reel; Technology: METAL FILM; Termination: Wraparound; JESD-609 Code: e3; RoHS Compliant: Yes; ComponentLink1URL: https://datasheet.ciiva.com:443/pdfs/VipMasterIC/IC/SUSU/SUSUS00222/SUSUS00222-1.pdf?src-supplier=IHS+Markit; ComponentLink1Description: https://datasheet.ciiva.com:443/pdfs/VipMasterIC/IC/SUSU/SUSUS00222/SUSUS00222-1.pdf?src-supplier=IHS+Markit; ComponentLink2URL: https://datasheet.ciiva.com/2490/rg-rm-rgh-datasheet-2490469.pdf?src-supplier=Digikey; ComponentLink2Description: https://datasheet.ciiva.com/2490/rg-rm-rgh-datasheet-2490469.pdf?src-supplier=Digikey; ComponentLink3URL: https://datasheet.ciiva.com/7984/1369790-7984253.pdf?src-supplier=Element14; ComponentLink3Description: https://datasheet.ciiva.com/7984/1369790-7984253.pdf?src-supplier=Element14
R28 = CMP-26527-001411-1: 22.1kΩ ±1% 0.125W 0805 Thick Film Chip Resistor AEC-Q200 compliant; Manufacturer: Stackpole Electronics; Temperature Coefficient: 100ppm/°C; Power Rating: 125mW; Rated Temperature: 70°C; Value: 22.1kR; Working Voltage: 150V; Package Height: 0.5mm; Package Length: 2mm; Package Width: 1.25mm; Min Operating Temperature: -55°C; Size Code: 0805; Max Operating Temperature: 155°C; Military Standard: Not; Features: Automotive AEC-Q200; Lead Free: Lead Free; Contact Plating: Tin; Tolerance: 1%; Series: RMCF; Resistor Type: Thick Film; Width: 0.049inch; Case Code (Imperial): 0805; Case/Package: 0805; Depth: 1.25mm; Mount: Surface Mount; RoHS Compliant: Yes; Max Power Dissipation: 125mW; Case Code (Metric): 2012; Height: 0.026inch; Construction: Rectangular; Number of Terminations: 2; Packaging: Tape and Reel; Radiation Hardening: No; Length: 0.079inch; Supplier: Digikey; Supplier Part Number: RMCF0805FT22K1CT-ND; Manufacturer Part Number: RMCF0805FT22K1; RoHS: Yes; Category: Chip SMD Resistors; Stock: 745768; Pricing: 1=0.1, 10=0.02, 50=0.0124, 100=0.0103, 500=0.007, 1000=0.00601 (USD); Mounting Technology: Surface Mount; Pins: 2; Package Shape: Rectangular; Terminal Finish: Nickel; JESD-609 Code: e3; Package Style: SMTMeter; Power: 125mW; Technology: METAL GLAZE/THICK FILM; Termination: Wraparound; Reference Standard: AEC-Q200; Reach SVHC Compliant: Yes; ComponentLink1URL: https://datasheet.ciiva.com:443/pdfs/VipMasterIC/IC/SEIE/SEIE-S-A0009541969/SEIE-S-A0009541969-1.pdf?src-supplier=IHS+Markit; ComponentLink1Description: https://datasheet.ciiva.com:443/pdfs/VipMasterIC/IC/SEIE/SEIE-S-A0009541969/SEIE-S-A0009541969-1.pdf?src-supplier=IHS+Markit; ComponentLink2URL: https://datasheet.ciiva.com/15193/getdatasheetpartid-409700-15193558.pdf?src-supplier=Verical; ComponentLink2Description: https://datasheet.ciiva.com/15193/getdatasheetpartid-409700-15193558.pdf?src-supplier=Verical
R29 = CMP-03211-007667-1: SMD Chip Resistor, Thin Film, 47.5KΩ, 100 V, 0805 [2012 Metric], 100 mW, 0.1%, RN73 Series; Manufacturer: TE Connectivity; Voltage Rating: 100V; Temperature Coefficient: 10ppm/°C; Power Rating: 0.1W; Additional Feature: PRECISION; Power: 100mW; Rated Temperature: 70°C; Category: Res; Manufacturer Part Number: RN73C2A47K5BTD; packaging: 5000 Reel; Temperature Range Low: -55°C; Device Class L3: Chip SMD Resistors; Height: 0.65mm; Automotive: No; ComponentLink2Description: Datasheet; Tolerance: 0.1%; ComponentLink2URL: https://www.te.com/commerce/DocumentDelivery/DDEController?Action=showdoc&DocId=Data+Sheet%7F1773270%7FP%7Fpdf%7FEnglish%7FENG_DS_1773270_P.pdf%7F1676162-2; RoHS: TRUE; Temperature Range High: 155°C; Lead Free: Yes; Octopart: https://octopart.com/rn73c2a47k5btd-te+connectivity-22736876; Package: RN732A; Device Class L1: Passive Components; Temperature: -55°C to 155°C; Device Class L2: Resistors; octopart_url: https://octopart.com/rn73c2a47k5btd-te+connectivity-22736876; Ipc Land Pattern Name: RESC200125X55; Resistance: 47.5KΩ; Series: RN73; Composition: Thin Film; Supplier: Digikey; Supplier Part Number: A119902CT-ND; Stock: 2760; Pricing: 1=0.73, 10=0.521, 50=0.3986, 100=0.3526, 500=0.26204, 1000=0.22944 (USD); Mounting Technology: Surface Mount; Pins: 2; Package Shape: Rectangular; Case/Package: 0805; Min Operating Temperature: -55°C; Max Operating Temperature: 125°C; Resistor Type: FIXED RESISTOR; Manufacturer Series: RN73; Technology: THIN FILM; Termination: Wraparound; Working Voltage: 100V; RoHS Compliant: Yes; ComponentLink1URL: https://datasheet.ciiva.com:443/pdfs/VipMasterIC/IC/TYEC/TYECS00448/TYECS00448-1.pdf?src-supplier=IHS+Markit; ComponentLink1Description: https://datasheet.ciiva.com:443/pdfs/VipMasterIC/IC/TYEC/TYECS00448/TYECS00448-1.pdf?src-supplier=IHS+Markit; ComponentLink3URL: https://datasheet.ciiva.com/2547/eng-ds-1773270-m-2547934.pdf?src-supplier=Digikey; ComponentLink3Description: https://datasheet.ciiva.com/2547/eng-ds-1773270-m-2547934.pdf?src-supplier=Digikey
U1 = CMP-08093-000007-1: IC USB TO UART BRIDGE QFN28